# Altium schematic sheet [08] - CPU - SPI, UART.SchDoc
size A2; DocumentNumber: 8; SheetNumber: 8; SheetTotal: 31
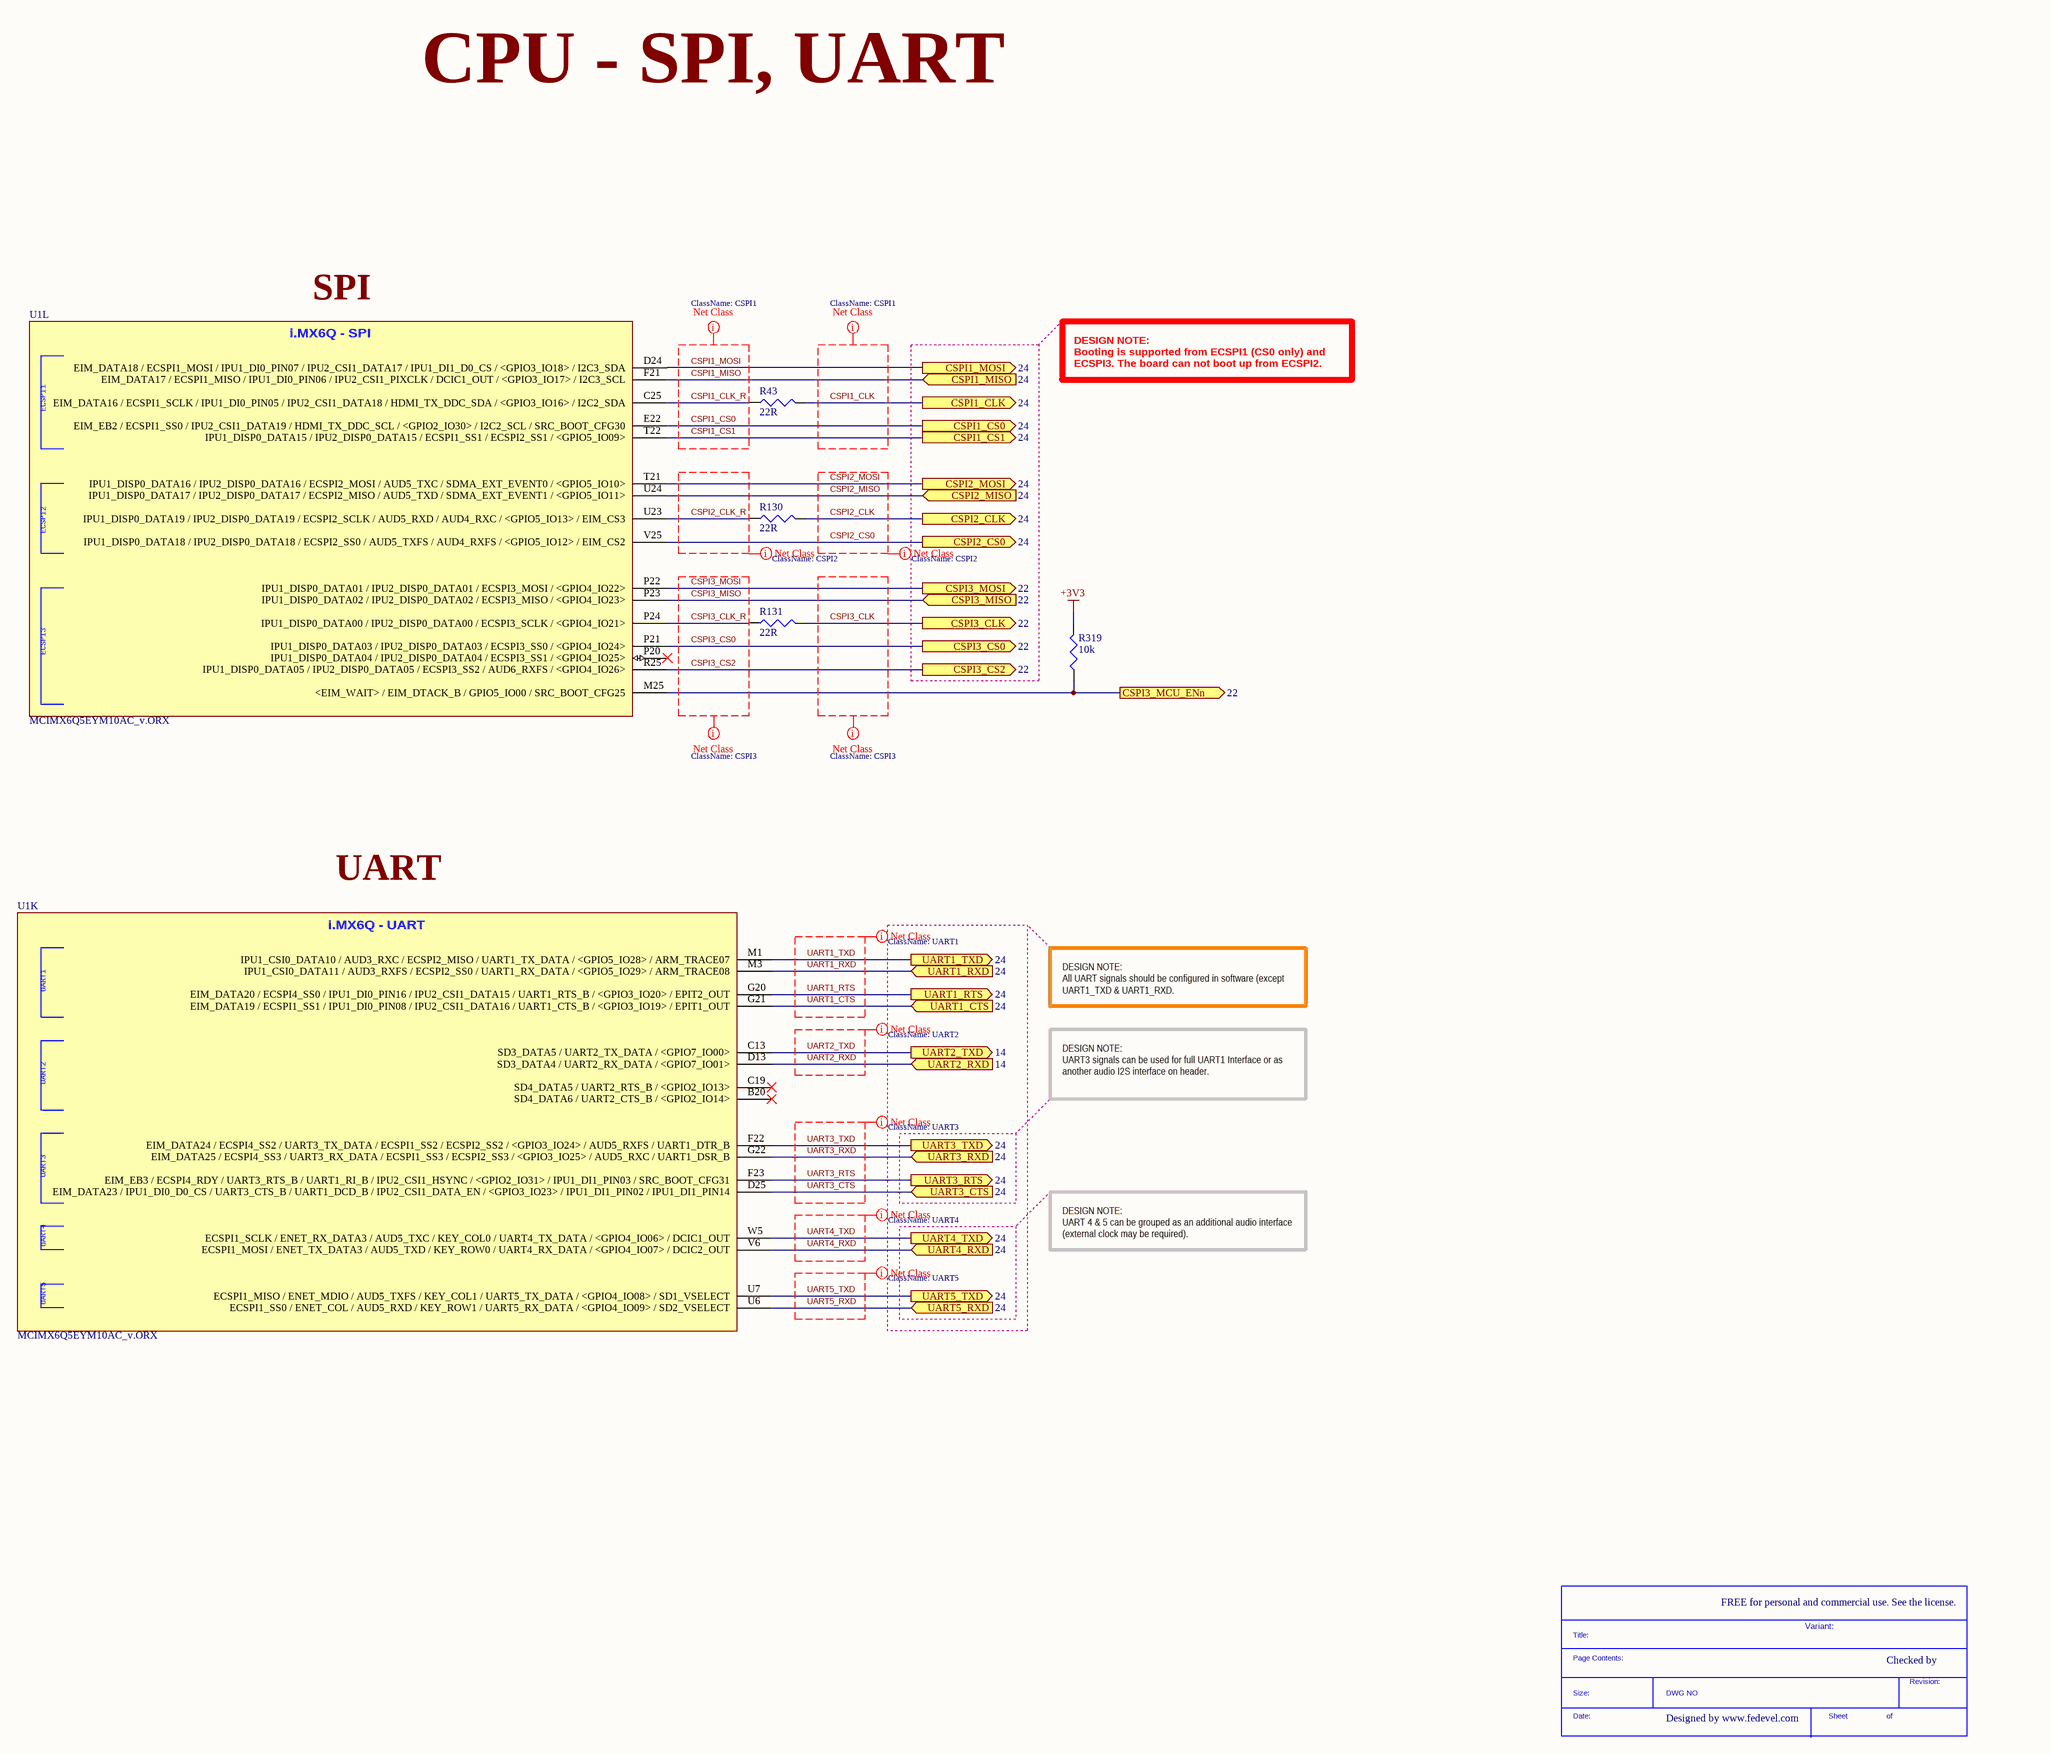
[diagram p0: [08] - CPU - SPI, UART.SchDoc]

## Parts
*  SDTitleBlock  (value not drawn)  (graphical)
R43  22R  [R0402]
R130  22R  [R0402]
R131  22R  [R0402]
R319  10k  [R0402]
U1  MCIMX6Q5EYM10AC_v.ORX  [PBGA624]  (parts K,L of 21)

## Ports
CSPI1_CLK (out, see 24), CSPI1_CS0 (out, see 24), CSPI1_CS1 (out, see 24), CSPI1_MISO (in, see 24), CSPI1_MOSI (out, see 24), CSPI2_CLK (out, see 24), CSPI2_CS0 (out, see 24), CSPI2_MISO (in, see 24), CSPI2_MOSI (out, see 24), CSPI3_CLK (see 22), CSPI3_CS0 (out, see 22), CSPI3_CS2 (out, see 22), CSPI3_MCU_ENn (out, see 22), CSPI3_MISO (in, see 22), CSPI3_MOSI (see 22), UART1_CTS (in, see 24), UART1_RTS (out, see 24), UART1_RXD (in, see 24), UART1_TXD (out, see 24), UART2_RXD (in, see 14), UART2_TXD (out, see 14), UART3_CTS (in, see 24), UART3_RTS (out, see 24), UART3_RXD (in, see 24), UART3_TXD (out, see 24), UART4_RXD (in, see 24), UART4_TXD (out, see 24), UART5_RXD (in, see 24), UART5_TXD (out, see 24)

## Nets
+3V3: R319.2
CSPI1_CLK: R43.2 ; port CSPI1_CLK
CSPI1_CLK_R: R43.1 U1.C25(EIM_DATA16_/_ECSPI1_SCLK_/_IPU1_DI0_PIN05_/_IPU2_CSI1_DATA18_/_HDMI_TX_DDC_SDA_/_<GPIO3_IO16>_/_I2C2_SDA)
CSPI1_CS0: U1.E22(EIM_EB2_/_ECSPI1_SS0_/_IPU2_CSI1_DATA19_/_HDMI_TX_DDC_SCL_/_<GPIO2_IO30>_/_I2C2_SCL_/_SRC_BOOT_CFG30) ; port CSPI1_CS0
CSPI1_CS1: U1.T22(IPU1_DISP0_DATA15_/_IPU2_DISP0_DATA15_/_ECSPI1_SS1_/_ECSPI2_SS1_/_<GPIO5_IO09>) ; port CSPI1_CS1
CSPI1_MISO: U1.F21(EIM_DATA17_/_ECSPI1_MISO_/_IPU1_DI0_PIN06_/_IPU2_CSI1_PIXCLK_/_DCIC1_OUT_/_<GPIO3_IO17>_/_I2C3_SCL) ; port CSPI1_MISO
CSPI1_MOSI: U1.D24(EIM_DATA18_/_ECSPI1_MOSI_/_IPU1_DI0_PIN07_/_IPU2_CSI1_DATA17_/_IPU1_DI1_D0_CS_/_<GPIO3_IO18>_/_I2C3_SDA) ; port CSPI1_MOSI
CSPI2_CLK: R130.2 ; port CSPI2_CLK
CSPI2_CLK_R: R130.1 U1.U23(IPU1_DISP0_DATA19_/_IPU2_DISP0_DATA19_/_ECSPI2_SCLK_/_AUD5_RXD_/_AUD4_RXC_/_<GPIO5_IO13>_/_EIM_CS3)
CSPI2_CS0: U1.V25(IPU1_DISP0_DATA18_/_IPU2_DISP0_DATA18_/_ECSPI2_SS0_/_AUD5_TXFS_/_AUD4_RXFS_/_<GPIO5_IO12>_/_EIM_CS2) ; port CSPI2_CS0
CSPI2_MISO: U1.U24(IPU1_DISP0_DATA17_/_IPU2_DISP0_DATA17_/_ECSPI2_MISO_/_AUD5_TXD_/_SDMA_EXT_EVENT1_/_<GPIO5_IO11>) ; port CSPI2_MISO
CSPI2_MOSI: U1.T21(IPU1_DISP0_DATA16_/_IPU2_DISP0_DATA16_/_ECSPI2_MOSI_/_AUD5_TXC_/_SDMA_EXT_EVENT0_/_<GPIO5_IO10>) ; port CSPI2_MOSI
CSPI3_CLK: R131.2 ; port CSPI3_CLK
CSPI3_CLK_R: R131.1 U1.P24(IPU1_DISP0_DATA00_/_IPU2_DISP0_DATA00_/_ECSPI3_SCLK_/_<GPIO4_IO21>)
CSPI3_CS0: U1.P21(IPU1_DISP0_DATA03_/_IPU2_DISP0_DATA03_/_ECSPI3_SS0_/_<GPIO4_IO24>) ; port CSPI3_CS0
CSPI3_CS2: U1.R25(IPU1_DISP0_DATA05_/_IPU2_DISP0_DATA05_/_ECSPI3_SS2_/_AUD6_RXFS_/_<GPIO4_IO26>) ; port CSPI3_CS2
CSPI3_MCU_ENn: R319.1 U1.M25(<EIM_WAIT>_/_EIM_DTACK_B_/_GPIO5_IO00_/_SRC_BOOT_CFG25) ; port CSPI3_MCU_ENn
CSPI3_MISO: U1.P23(IPU1_DISP0_DATA02_/_IPU2_DISP0_DATA02_/_ECSPI3_MISO_/_<GPIO4_IO23>) ; port CSPI3_MISO
CSPI3_MOSI: U1.P22(IPU1_DISP0_DATA01_/_IPU2_DISP0_DATA01_/_ECSPI3_MOSI_/_<GPIO4_IO22>) ; port CSPI3_MOSI
UART1_CTS: U1.G21(EIM_DATA19_/_ECSPI1_SS1_/_IPU1_DI0_PIN08_/_IPU2_CSI1_DATA16_/_UART1_CTS_B_/_<GPIO3_IO19>_/_EPIT1_OUT) ; port UART1_CTS
UART1_RTS: U1.G20(EIM_DATA20_/_ECSPI4_SS0_/_IPU1_DI0_PIN16_/_IPU2_CSI1_DATA15_/_UART1_RTS_B_/_<GPIO3_IO20>_/_EPIT2_OUT) ; port UART1_RTS
UART1_RXD: U1.M3(IPU1_CSI0_DATA11_/_AUD3_RXFS_/_ECSPI2_SS0_/_UART1_RX_DATA_/_<GPIO5_IO29>_/_ARM_TRACE08) ; port UART1_RXD
UART1_TXD: U1.M1(IPU1_CSI0_DATA10_/_AUD3_RXC_/_ECSPI2_MISO_/_UART1_TX_DATA_/_<GPIO5_IO28>_/_ARM_TRACE07) ; port UART1_TXD
UART2_RXD: U1.D13(SD3_DATA4_/_UART2_RX_DATA_/_<GPIO7_IO01>) ; port UART2_RXD
UART2_TXD: U1.C13(SD3_DATA5_/_UART2_TX_DATA_/_<GPIO7_IO00>) ; port UART2_TXD
UART3_CTS: U1.D25(EIM_DATA23_/_IPU1_DI0_D0_CS_/_UART3_CTS_B_/_UART1_DCD_B_/_IPU2_CSI1_DATA_EN_/_<GPIO3_IO23>_/_IPU1_DI1_PIN02_/_IPU1_DI1_PIN14) ; port UART3_CTS
UART3_RTS: U1.F23(EIM_EB3_/_ECSPI4_RDY_/_UART3_RTS_B_/_UART1_RI_B_/_IPU2_CSI1_HSYNC_/_<GPIO2_IO31>_/_IPU1_DI1_PIN03_/_SRC_BOOT_CFG31) ; port UART3_RTS
UART3_RXD: U1.G22(EIM_DATA25_/_ECSPI4_SS3_/_UART3_RX_DATA_/_ECSPI1_SS3_/_ECSPI2_SS3_/_<GPIO3_IO25>_/_AUD5_RXC_/_UART1_DSR_B) ; port UART3_RXD
UART3_TXD: U1.F22(EIM_DATA24_/_ECSPI4_SS2_/_UART3_TX_DATA_/_ECSPI1_SS2_/_ECSPI2_SS2_/_<GPIO3_IO24>_/_AUD5_RXFS_/_UART1_DTR_B) ; port UART3_TXD
UART4_RXD: U1.V6(ECSPI1_MOSI_/_ENET_TX_DATA3_/_AUD5_TXD_/_KEY_ROW0_/_UART4_RX_DATA_/_<GPIO4_IO07>_/_DCIC2_OUT) ; port UART4_RXD
UART4_TXD: U1.W5(ECSPI1_SCLK_/_ENET_RX_DATA3_/_AUD5_TXC_/_KEY_COL0_/_UART4_TX_DATA_/_<GPIO4_IO06>_/_DCIC1_OUT) ; port UART4_TXD
UART5_RXD: U1.U6(ECSPI1_SS0_/_ENET_COL_/_AUD5_RXD_/_KEY_ROW1_/_UART5_RX_DATA_/_<GPIO4_IO09>_/_SD2_VSELECT) ; port UART5_RXD
UART5_TXD: U1.U7(ECSPI1_MISO_/_ENET_MDIO_/_AUD5_TXFS_/_KEY_COL1_/_UART5_TX_DATA_/_<GPIO4_IO08>_/_SD1_VSELECT) ; port UART5_TXD

Not connected (* = marked no-connect by the designer): U1 B20(SD4_DATA6_/_UART2_CTS_B_/_<GPIO2_IO14>)* C19(SD4_DATA5_/_UART2_RTS_B_/_<GPIO2_IO13>)* P20(IPU1_DISP0_DATA04_/_IPU2_DISP0_DATA04_/_ECSPI3_SS1_/_<GPIO4_IO25>)*

## Layout directives
net class UART1: UART1_CTS, UART1_RTS, UART1_RXD, UART1_TXD
net class CSPI1: CSPI1_CLK, CSPI1_CLK_R, CSPI1_CS0, CSPI1_CS1, CSPI1_MISO, CSPI1_MOSI
net class CSPI3: CSPI3_CLK, CSPI3_CLK_R, CSPI3_CS0, CSPI3_CS2, CSPI3_MISO, CSPI3_MOSI
net class UART3: UART3_CTS, UART3_RTS, UART3_RXD, UART3_TXD
net class CSPI2: CSPI2_CLK, CSPI2_CLK_R, CSPI2_CS0, CSPI2_MISO, CSPI2_MOSI
net class UART4: UART4_RXD, UART4_TXD
net class UART5: UART5_RXD, UART5_TXD
net class UART2: UART2_RXD, UART2_TXD

## Notes on the sheet
- CPU - SPI, UART
- SPI
- DESIGN NOTE:
  Booting is supported from ECSPI1 (CS0 only) and ECSPI3. The board can not boot up from ECSPI2.
- UART
- DESIGN NOTE:
  All UART signals should be configured in software (except UART1_TXD & UART1_RXD.
- DESIGN NOTE:
  UART3 signals can be used for full UART1 Interface or as another audio I2S interface on header.
- DESIGN NOTE:
  UART 4 & 5 can be grouped as an additional audio interface (external clock may be required).
- FREE for personal and commercial use. See the license.
- Variant:
- Checked by
- Designed by www.fedevel.com
- (in symbol MCIMX6Q5EYM10AC_v.ORX, part K) i.MX6Q - UART; UART1; UART2; UART3; UART4; UART5
- (in symbol MCIMX6Q5EYM10AC_v.ORX, part L) i.MX6Q - SPI; ECSPI1; ECSPI2; ECSPI3
- (in symbol SDTitleBlock) Title:; Page Contents:; Revision:; Size:; DWG NO; Date:; Sheet; of

## Library data of the parts
R43 R130 R131 = RC0402FR-0722RL: RES 22.0 OHM 1/16W 1% 0402 SMD; Manufacturer: Yageo; Resistance (Ohms): 22; Power (Watts): 0.063W, 1/16W; .Checked PCB: used; Temperature Coefficient: ±100ppm/°C; Category: Resistors; Supplier Part Number: 311-22.0LRCT-ND; Manufacturer Part Number: RC0402FR-0722RL; Package / Case: 0402 (1005 Metric); Price 1k [$]: 0.01421; Tolerance: ±1%; Value: 22R; .Checked SCH: used; Supplier: Digikey; Supplier 1: Digi-Key; Supplier Part Number 1: 311-22.0LRCT-ND; RoHS: RoHS Compliant; Stock 1: 943800; Pricing 1: 10=0.014, 50=0.0104, 100=0.0079, 250=0.00584, 500=0.00432, 1000=0.00288 (USD); Composition: Thick Film; Features: -; Size / Dimension: 0.039" L x 0.020" W (1.00mm x 0.50mm); Height: 0.016" (0.40mm); Number of Terminations: 2; Packaging: Cut Tape (CT); ComponentLink1URL: http://www.yageo.com/documents/recent/PYu-RC0402_51_RoHS_L_6.pdf; ComponentLink1Description: http://www.yageo.com/documents/recent/PYu-RC0402_51_RoHS_L_6.pdf
R319 = RC0402FR-0710KL: RES 10.0K OHM 1/16W 1% 0402 SMD; Manufacturer: Yageo; Power (Watts): 0.063W, 1/16W; .Checked PCB: used; Temperature Coefficient: ±100ppm/°C; Category: Resistors; Supplier Part Number: 311-10.0KLRCT-ND; Manufacturer Part Number: RC0402FR-0710KL; Package / Case: 0402 (1005 Metric); Price 1k [$]: 0.01421; Resistance (Ohms): 10K; Tolerance: ±1%; Value: 10k; .Checked SCH: used; Supplier: Digikey; Supplier 1: Digi-Key; Supplier Part Number 1: 311-10.0KLRCT-ND; RoHS: RoHS Compliant; Stock 1: 2916495; Pricing 1: 10=0.014, 50=0.0104, 100=0.0079, 250=0.00584, 500=0.00432, 1000=0.00288 (USD); Composition: Thick Film; Features: -; Size / Dimension: 0.039" L x 0.020" W (1.00mm x 0.50mm); Height: 0.016" (0.40mm); Number of Terminations: 2; Packaging: Cut Tape (CT); ComponentLink1URL: http://www.yageo.com/documents/recent/PYu-RC0402_51_RoHS_L_6.pdf; ComponentLink1Description: http://www.yageo.com/documents/recent/PYu-RC0402_51_RoHS_L_6.pdf
U1 = MCIMX6Q5EYM10AC_v.ORX: IC MCU 32BIT ARM QUAD 624FCBGA; Manufacturer: Freescale Semiconductor; Core Processor: ARM® Cortex™-A9; Core Size: 32-Bit Quad-Core; Speed: 1.0GHz; Connectivity: CAN, EBI/EMI, ESAI, Ethernet, GPMI, I2C, MMC/SD, PCI, SATA, SPI, UART, USB, USB OTG; Peripherals: DMA, HDMI, I2S/SSI/AC97, MIPI CSI, MIMI DSI, MIPI HIS, PWM, WDT; Number of I /O: 224; Program Memory Type: External Program Memory; RAM Size: 256K x 8; Voltage - Supply (Vcc/Vdd): 0.925 V ~ 1.5 V; Oscillator Type: Internal; .Creator: MM; .Checked PCB: MM, checked by RF; Supplier 1: Digi-Key; Manufacturer Part Number: MCIMX6Q5EYM10AC; RoHS: RoHS Compliant; Category: Integrated Circuits (ICs); Stock 1: 0; Pricing 1: 1=54.98, 10=51.922, 25=48.868, 100=30.5424 (USD); Program Memory Size: -; EEPROM Size: -; Data Converters: -; Operating Temperature: -20°C ~ 105°C; Package / Case: 624-FBGA, FCBGA; Packaging: Tray; ComponentLink1URL: http://cache.freescale.com/files/32bit/doc/data_sheet/IMX6DQCEC.pdf; ComponentLink1Description: http://cache.freescale.com/files/32bit/doc/data_sheet/IMX6DQCEC.pdf; Supplier Part Number 1: MCIMX6Q5EYM10AC-ND